# EAGLE design Glint-Module (EAGLE 6.4)
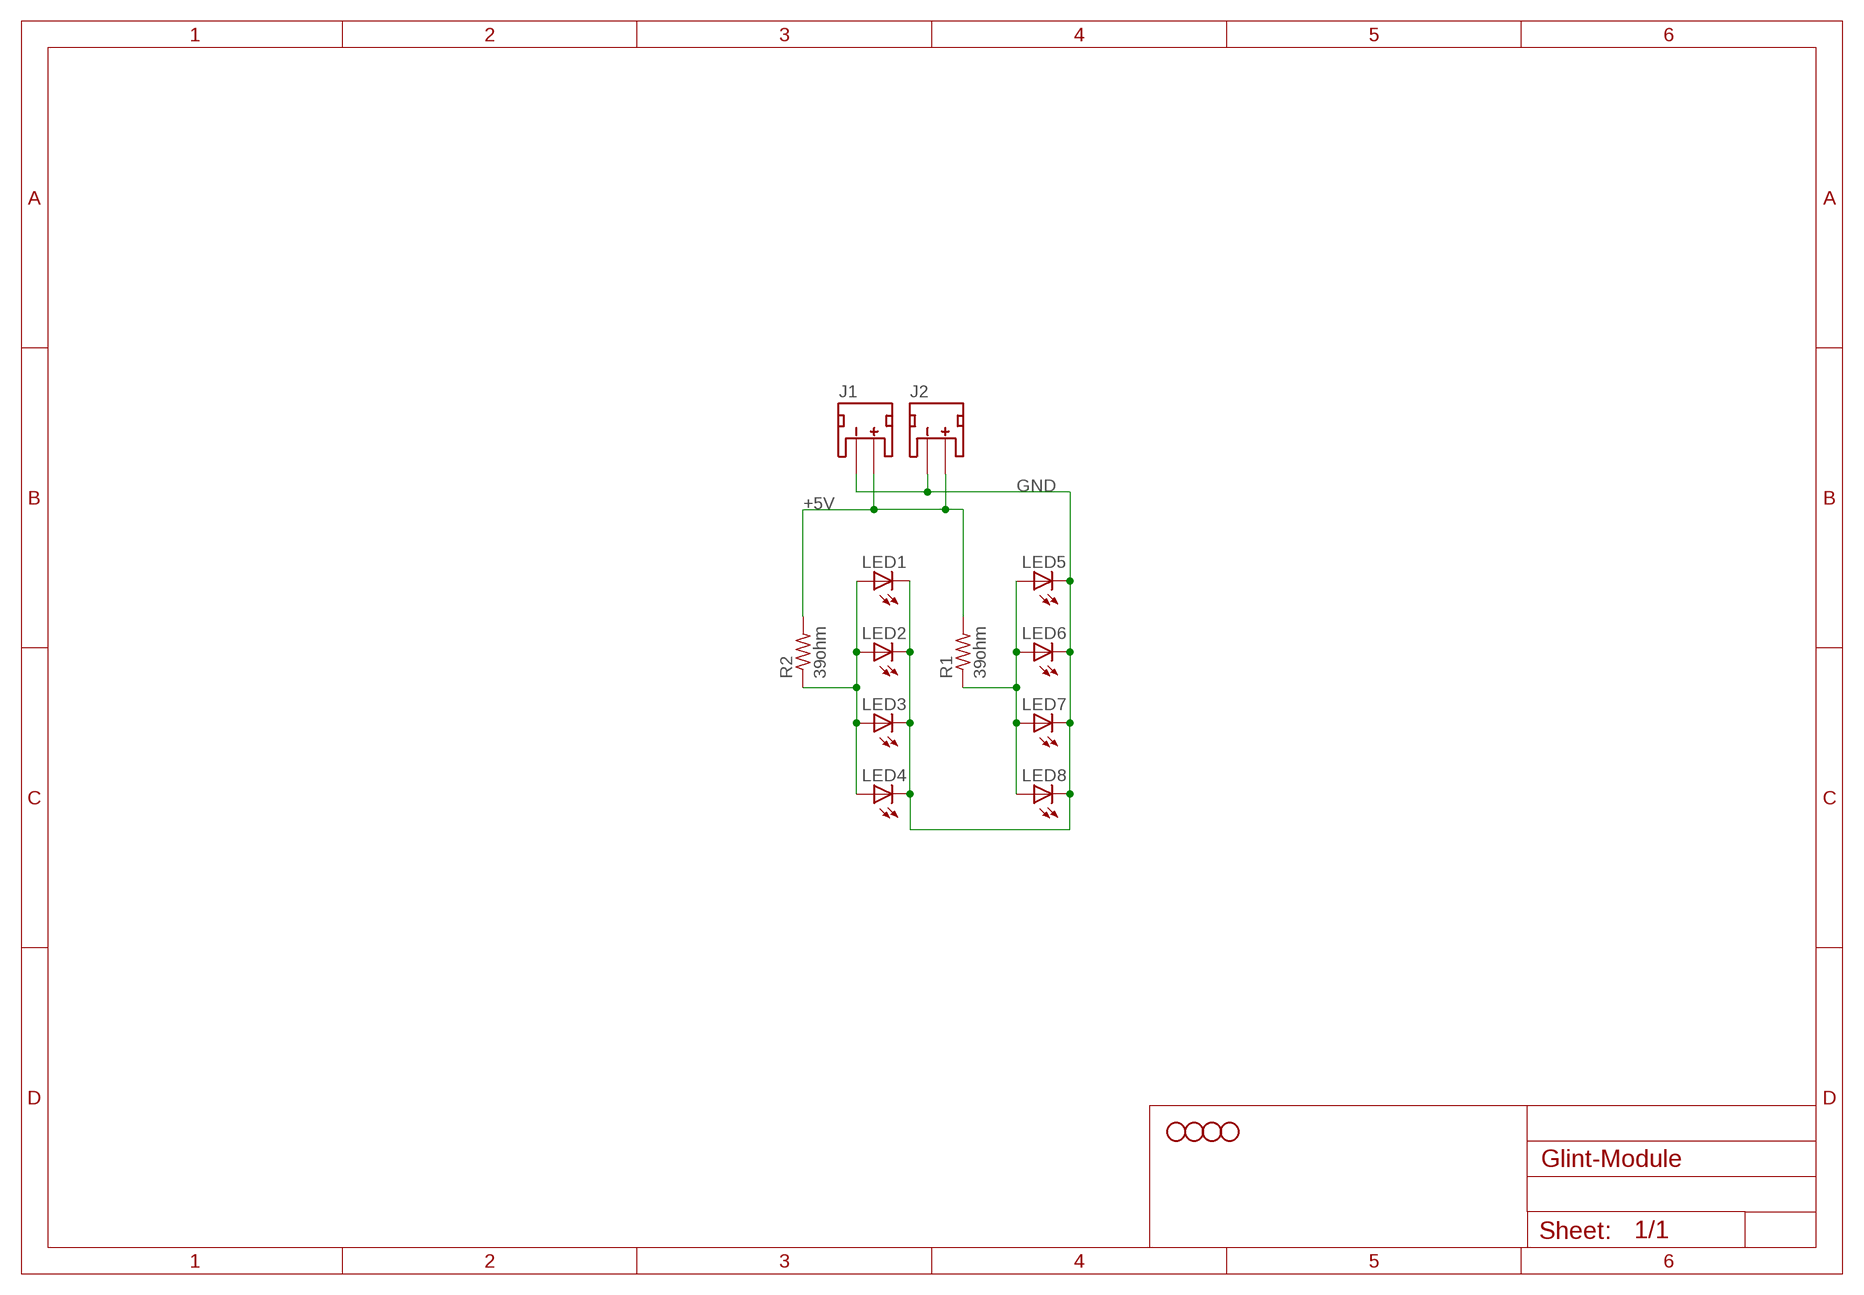
[diagram p0: schematic, sheet 1]

## Parts
J1  JST_2MM_MALE  [JST-2-SMD]
J2  JST_2MM_MALE  [JST-2-SMD]
LED1  LED5MM  [LED5MM]
LED2  LED5MM  [LED5MM]
LED3  LED5MM  [LED5MM]
LED4  LED5MM  [LED5MM]
LED5  LED5MM  [LED5MM]
LED6  LED5MM  [LED5MM]
LED7  LED5MM  [LED5MM]
LED8  LED5MM  [LED5MM]
R1  39ohm  R-US_0309/10  [0309/10]
R2  39ohm  R-US_0309/10  [0309/10]
STANDOFF1  STAND-OFF  [STAND-OFF]
STANDOFF2  STAND-OFF  [STAND-OFF]
STANDOFF3  STAND-OFF  [STAND-OFF]
STANDOFF4  STAND-OFF  [STAND-OFF]

## Nets
+5V: J1.2(+) J2.2(+) R1.2 R2.2
GND: J1.1(-) J2.1(-) LED1.K(C) LED2.K(C) LED3.K(C) LED4.K(C) LED5.K(C) LED6.K(C) LED7.K(C) LED8.K(C)
N$1: LED1.A LED2.A LED3.A LED4.A R2.1
N$3: LED5.A LED6.A LED7.A LED8.A R1.1
Unconnected: J1.NC1(PAD1) J1.NC2(PAD2) J2.NC1(PAD1) J2.NC2(PAD2)

## Library data of the parts
J1 J2 = SparkFun-Connectors:JST_2MM_MALE: Mates to single-cell LiPo batteries. CONN-08352; PROD_ID: CONN-08352
LED1-LED8 = SparkFun-LED:LED: LEDs Standard schematic elements and footprints for 5mm, 3mm, 1206, and 0603 sized LEDs. 5mm - Spark Fun Electronics SKU : COM-00529 (and others)
R1 R2 = resistor:R-US_: RESISTOR, American symbol
STANDOFF1-STANDOFF4 = SparkFun-Electromechanical:STAND-OFF: #4 Stand Off This is the mechanical footprint for a #4 phillips button head screw. Use the keepout ring to avoid running the screw head into surrounding components. SKU : PRT-00447

## Board
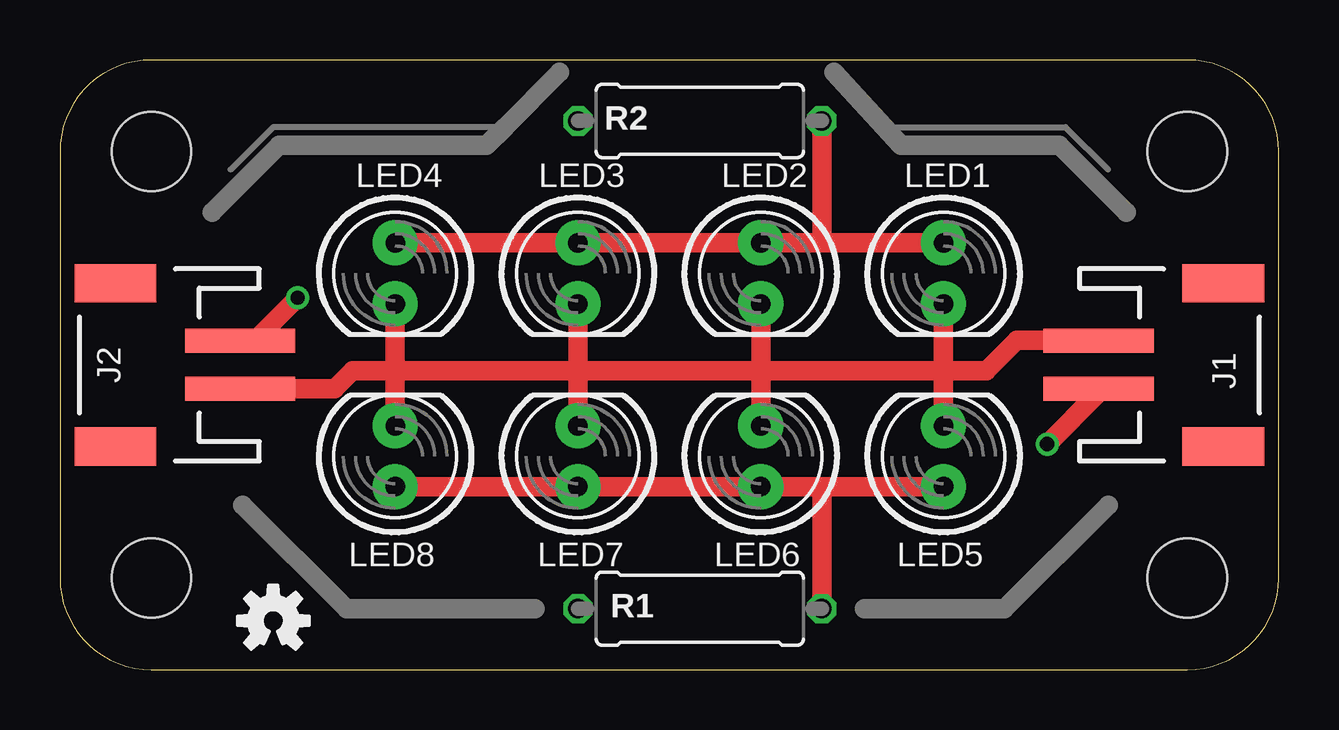
[diagram p1: board, top side]
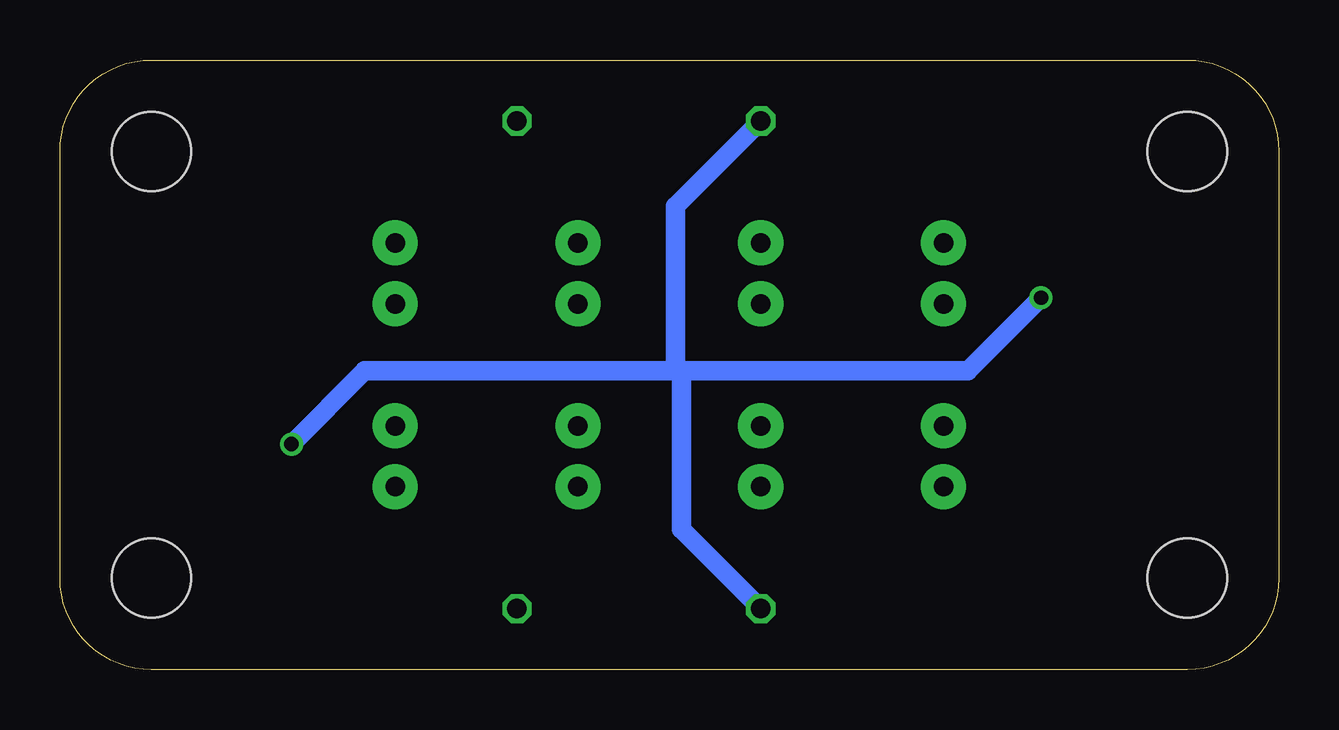
[diagram p2: board, bottom side, seen from below]

Size 50.8 x 25.4 mm. Coordinates in mm from the lower left corner, seen from the top.
Outline: 3.81,0 46.99,0 arc90 50.8,3.81 50.8,21.59 arc90 46.99,25.4 3.81,25.4 arc90 0,21.59 0,3.81 arc90 3.81,0
Copper layers (1*16): Top 0.0356mm / dielectric 1.5011mm / Bottom 0.0356mm
Design rules "LaenPCBOrder": minimum track width 6mil, minimum drill 13mil, track to track 6mil, track to pad 6mil, pad to pad 6mil, via to via 6mil, smd to smd 6mil, copper to edge 15mil, drill to drill 6mil, minimum pad ring 7mil, minimum via ring 7mil, stop-mask expansion 4mil, vias tented up to drill 0mil, thermal gap 10mil

### Footprints (pad centres in the part's own frame; a part is rotated, then mirrored left to right if it is on the bottom)
JST-2-SMD = smd 1 x 4.6: 1 -1,-3.7; 2 1,-3.7 | smd 1.6 x 3.4: NC1 -3.4,1.5; NC2 3.4,1.5
LED5MM = drill 0.813 pad 1.88: A -1.27,0; K 1.27,0
0309/10 = drill 0.813 octagon: 1 -5.08,0; 2 5.08,0
STAND-OFF = hole 3.302: 0,0

### Placement (x,y rotation side)
J1  46.99,12.7 270 top
J2  3.81,12.7 90 top
LED1  36.83,16.51 270 top
LED2  29.21,16.51 270 top
LED3  21.59,16.51 270 top
LED4  13.97,16.51 270 top
LED5  36.83,8.89 90 top
LED6  29.21,8.89 90 top
LED7  21.59,8.89 90 top
LED8  13.97,8.89 90 top
R1  26.67,2.54 180 top
R2  26.67,22.86 180 top
STANDOFF1  3.81,3.81 0 top
STANDOFF2  3.81,21.59 0 top
STANDOFF3  46.99,3.81 0 top
STANDOFF4  46.99,21.59 0 top
U$1  [OSHW-LOGO-S]  8.89,2.03 0 top

### Tracks (layer width: path | path; a pad name or v marks a point on that pad's centre or on a via)
+5V  (via drill 0.6)
  Top 0.813: J2.2 8.11,13.7 v9.91,15.49 | J1.2 43.29,11.54 v41.15,9.4
  Bottom 0.813: v9.91,15.49 12.95,12.45 24.89,12.45 | 24.89,12.45 25.15,12.45 | 25.15,12.45 38.1,12.45 v41.15,9.4 | R1.2 24.89,5.84 24.89,12.45 | R2.2 25.15,19.3 25.15,12.45
GND
  Top 0.813: J2.1 11.45,11.7 12.19,12.45 13.72,12.45 | 13.72,12.45 14.22,12.45 | 14.22,12.45 21.34,12.45 | 21.34,12.45 21.84,12.45 | 21.84,12.45 28.96,12.45 | 28.96,12.45 29.21,12.45 | 29.21,12.45 36.58,12.45 | 36.58,12.45 37.08,12.45 | 37.08,12.45 38.61,12.45 39.88,13.72 43.27,13.72 J1.1 | LED8.K 13.97,12.19 14.22,12.45 | LED7.K 21.59,12.19 21.84,12.45 | LED6.K 29.21,12.19 28.96,12.45 | LED5.K 36.83,12.19 36.58,12.45 | LED1.K 36.83,12.7 37.08,12.45 | LED2.K 29.21,12.45 | LED3.K 21.59,12.7 21.34,12.45 | LED4.K 13.97,12.7 13.72,12.45
N$1
  Top 0.813: LED4.A LED3.A LED2.A 31.5,17.78 | 31.5,17.78 LED1.A | R2.1 31.75,18.03 31.5,17.78
N$3
  Top 0.813: LED8.A LED7.A LED6.A 32,7.62 | 32,7.62 LED5.A | R1.1 31.75,7.37 32,7.62

### Text on the board
tDocu: Eyewriter 2.1 | Glint board | OSHW
bDocu: Glint board | Eyewrtier 2.1 | Designed by Jason Webb (http://jason-webb.info)